# Altium schematic sheet Sheet1.SchDoc
size A3; SheetNumber: 1; SheetTotal: 1
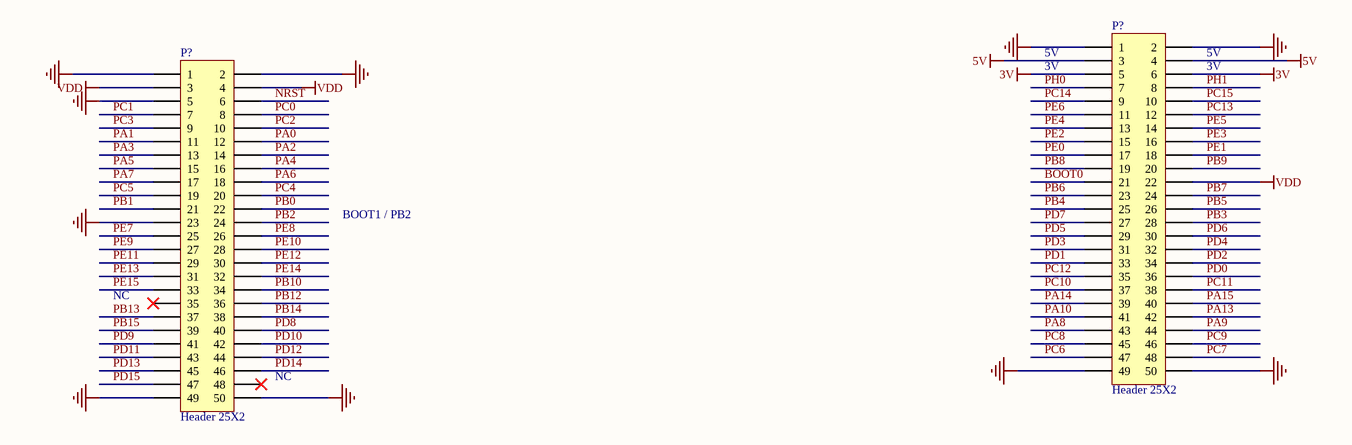
[diagram p0: Sheet1.SchDoc]

## Parts
(Parts that share a designator on the sheet are numbered #1, #2 ... from top to bottom, then left to right.)
P?#1  Header 25X2  [HDR2X25 (Primary)]
P?#2  Header 25X2  [HDR2X25 (Primary)]

## Nets
3V: P?#1.5 P?#1.6
5V: P?#1.3 P?#1.4
GND: P?#1.1 P?#1.2 P?#1.49 P?#1.50 P?#2.1 P?#2.2 P?#2.5 P?#2.23 P?#2.49 P?#2.50
VDD: P?#1.22 P?#2.3 P?#2.4
BOOT0: P?#1.21
NRST: P?#2.6
PA0: P?#2.12
PA1: P?#2.11
PA2: P?#2.14
PA3: P?#2.13
PA4: P?#2.16
PA5: P?#2.15
PA6: P?#2.18
PA7: P?#2.17
PA8: P?#1.43
PA9: P?#1.44
PA10: P?#1.41
PA13: P?#1.42
PA14: P?#1.39
PA15: P?#1.40
PB0: P?#2.22
PB1: P?#2.21
PB2: P?#2.24
PB3: P?#1.28
PB4: P?#1.25
PB5: P?#1.26
PB6: P?#1.23
PB7: P?#1.24
PB8: P?#1.19
PB9: P?#1.20
PB10: P?#2.34
PB12: P?#2.36
PB13: P?#2.37
PB14: P?#2.38
PB15: P?#2.39
PC0: P?#2.8
PC1: P?#2.7
PC2: P?#2.10
PC3: P?#2.9
PC4: P?#2.20
PC5: P?#2.19
PC6: P?#1.47
PC7: P?#1.48
PC8: P?#1.45
PC9: P?#1.46
PC10: P?#1.37
PC11: P?#1.38
PC12: P?#1.35
PC13: P?#1.12
PC14: P?#1.9
PC15: P?#1.10
PD0: P?#1.36
PD1: P?#1.33
PD2: P?#1.34
PD3: P?#1.31
PD4: P?#1.32
PD5: P?#1.29
PD6: P?#1.30
PD7: P?#1.27
PD8: P?#2.40
PD9: P?#2.41
PD10: P?#2.42
PD11: P?#2.43
PD12: P?#2.44
PD13: P?#2.45
PD14: P?#2.46
PD15: P?#2.47
PE0: P?#1.17
PE1: P?#1.18
PE2: P?#1.15
PE3: P?#1.16
PE4: P?#1.13
PE5: P?#1.14
PE6: P?#1.11
PE7: P?#2.25
PE8: P?#2.26
PE9: P?#2.27
PE10: P?#2.28
PE11: P?#2.29
PE12: P?#2.30
PE13: P?#2.31
PE14: P?#2.32
PE15: P?#2.33
PH0: P?#1.7
PH1: P?#1.8

Not connected (* = marked no-connect by the designer): P?#2 35* 48*

## Notes on the sheet
- 5V
- 3V
- (near P?#1) 5V
- (near P?#1) 3V
- BOOT1 / PB2
- NC
- (near P?#2) NC
- Page Contents:
- TOPIC : AGV Path Following and Mapping Using SLAM with ROS
- SCHEMATIC PBL4
- MEMBERS:
- Size:
- Date:
- Drawn By:
- A3
- GROUP 1
- Number:
- Time:
- 0901491550
- CLASS
- Revision:
- Sheet
- 21.Nh05
- NGUYEN VAN THANH
- PHAN DANG DANH
- Instructor:
- DR. PHAM ANH DUC

## Library data of the parts
P?#1 P?#2 = Header 25X2: Header, 25-Pin, Dual row; LatestRevisionDate: 17-Jul-2002; LatestRevisionNote: Re-released for DXP Platform.; Publisher: Altium Limited